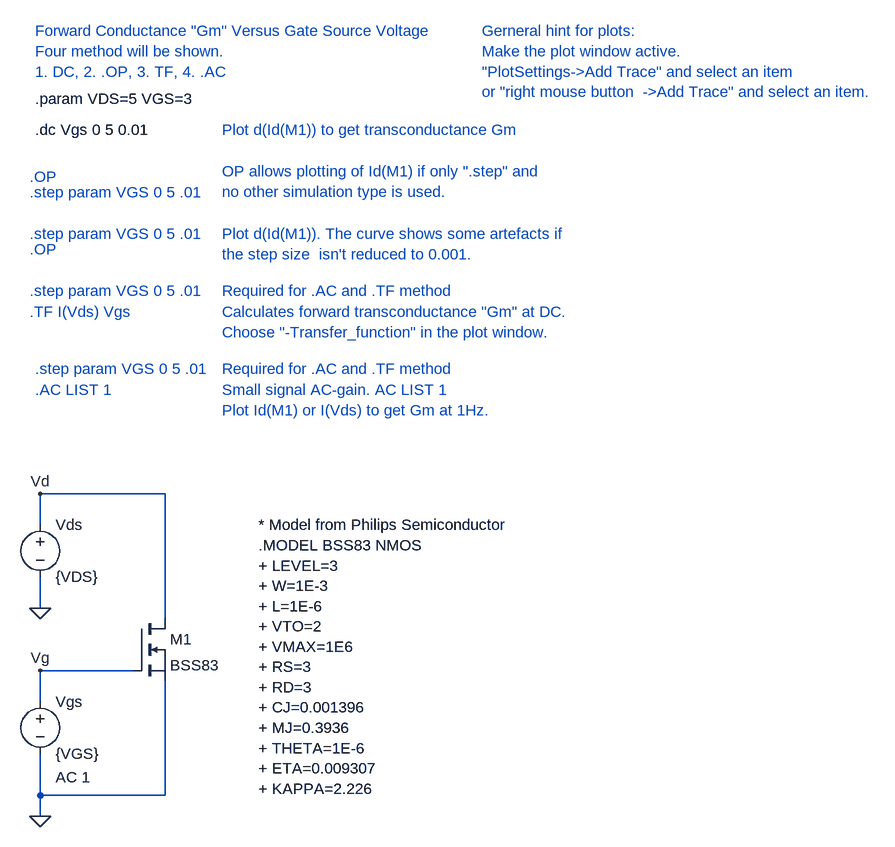
[diagram p0: schematic gm_of_vgs_const_vds1.asc]
gm_of_vgs_const_vds1.asc, the LTspice schematic file:
Version 4
SHEET 1 1708 724
WIRE 96 208 -96 208
WIRE -96 256 -96 208
WIRE -96 384 -96 336
WIRE 96 400 96 208
WIRE 48 480 -96 480
WIRE -96 528 -96 480
WIRE -96 672 -96 608
WIRE 96 672 96 496
WIRE 96 672 -96 672
WIRE -96 704 -96 672
FLAG -96 704 0
FLAG -96 384 0
FLAG -96 208 Vd
FLAG -96 480 Vg
SYMBOL voltage -96 512 R0
WINDOW 123 24 132 Left 0
WINDOW 39 0 0 Left 0
SYMATTR Value2 AC 1
SYMATTR InstName Vgs
SYMATTR Value {VGS}
SYMBOL voltage -96 240 R0
WINDOW 123 24 132 Left 0
WINDOW 39 0 0 Left 0
SYMATTR InstName Vds
SYMATTR Value {VDS}
SYMBOL nmos 48 400 R0
SYMATTR InstName M1
SYMATTR Value BSS83
TEXT -104 16 Left 0 ;.step param VGS 0 5 .01
TEXT -112 -168 Left 0 ;.OP
TEXT -112 -72 Left 0 ;.TF I(Vds) Vgs
TEXT -104 48 Left 0 ;.AC LIST 1
TEXT 184 48 Left 0 ;Small signal AC-gain. AC LIST 1\nPlot Id(M1) or I(Vds) to get Gm at 1Hz.
TEXT 184 -72 Left 0 ;Calculates forward transconductance "Gm" at DC.\nChoose "-Transfer_function" in the plot window.
TEXT 184 -288 Left 0 ;OP allows plotting of Id(M1) if only ".step" and \nno other simulation type is used.
TEXT -104 -504 Left 0 ;Forward Conductance "Gm" Versus Gate Source Voltage\nFour method will be shown.\n1. DC, 2. .OP, 3. TF, 4. .AC
TEXT 584 -504 Left 0 ;Gerneral hint for plots:\nMake the plot window active. \n"PlotSettings->Add Trace" and select an item\nor "right mouse button  ->Add Trace" and select an item.
TEXT -104 -400 Left 0 !.param VDS=5 VGS=3
TEXT 240 256 Left 0 !* Model from Philips Semiconductor\n.MODEL BSS83 NMOS\n+ LEVEL=3\n+ W=1E-3\n+ L=1E-6\n+ VTO=2\n+ VMAX=1E6\n+ RS=3\n+ RD=3\n+ CJ=0.001396\n+ MJ=0.3936\n+ THETA=1E-6\n+ ETA=0.009307\n+ KAPPA=2.226
TEXT 184 16 Left 0 ;Required for .AC and .TF method
TEXT -104 -352 Left 0 !.dc Vgs 0 5 0.01
TEXT 184 -352 Left 0 ;Plot d(Id(M1)) to get transconductance Gm
TEXT 184 -104 Left 0 ;Required for .AC and .TF method
TEXT -112 -104 Left 0 ;.step param VGS 0 5 .01
TEXT -112 -192 Left 0 ;.step param VGS 0 5 .01
TEXT 184 -192 Left 0 ;Plot d(Id(M1)). The curve shows some artefacts if \nthe step size  isn't reduced to 0.001.
TEXT -112 -256 Left 0 ;.step param VGS 0 5 .01
TEXT -112 -280 Left 0 ;.OP

The netlist it stands for:
* gm_of_vgs_const_vds1.asc
Vgs Vg 0 {VGS} AC 1
Vds Vd 0 {VDS}
M1 Vd Vg 0 0 BSS83
.model NMOS NMOS
.model PMOS PMOS
.lib standard.mos
* .step param VGS 0 5 .01
* .OP
* .TF I(Vds) Vgs
* .AC LIST 1
* Small signal AC-gain. AC LIST 1
* Plot Id(M1) or I(Vds) to get Gm at 1Hz.
* Calculates forward transconductance "Gm" at DC.
* Choose "-Transfer_function" in the plot window.
* OP allows plotting of Id(M1) if only ".step" and
* no other simulation type is used.
* Forward Conductance "Gm" Versus Gate Source Voltage
* Four method will be shown.
* 1. DC, 2. .OP, 3. TF, 4. .AC
* Gerneral hint for plots:
* Make the plot window active.
* "PlotSettings->Add Trace" and select an item
* or "right mouse button  ->Add Trace" and select an item.
.param VDS=5 VGS=3
* Model from Philips Semiconductor
.MODEL BSS83 NMOS
+ LEVEL=3
+ W=1E-3
+ L=1E-6
+ VTO=2
+ VMAX=1E6
+ RS=3
+ RD=3
+ CJ=0.001396
+ MJ=0.3936
+ THETA=1E-6
+ ETA=0.009307
+ KAPPA=2.226
* Required for .AC and .TF method
.dc Vgs 0 5 0.01
* Plot d(Id(M1)) to get transconductance Gm
* Required for .AC and .TF method
* .step param VGS 0 5 .01
* .step param VGS 0 5 .01
* Plot d(Id(M1)). The curve shows some artefacts if
* the step size  isn't reduced to 0.001.
* .step param VGS 0 5 .01
* .OP
.backanno
.end